# Altium schematic sheet [13]-TYPEC0_PROG.SchDoc: RK3399 SOM Board Design V1.0
size A3; Author: ABC; Organization: Altium Limited; Address1: L3, 12a Rodborough Rd; Address2: Frenchs Forest; Address3: NSW; Address4: Australia 2086; DocumentNumber: 15; SheetNumber: 15; SheetTotal: 21; PROJECT CODE: A_V1.0
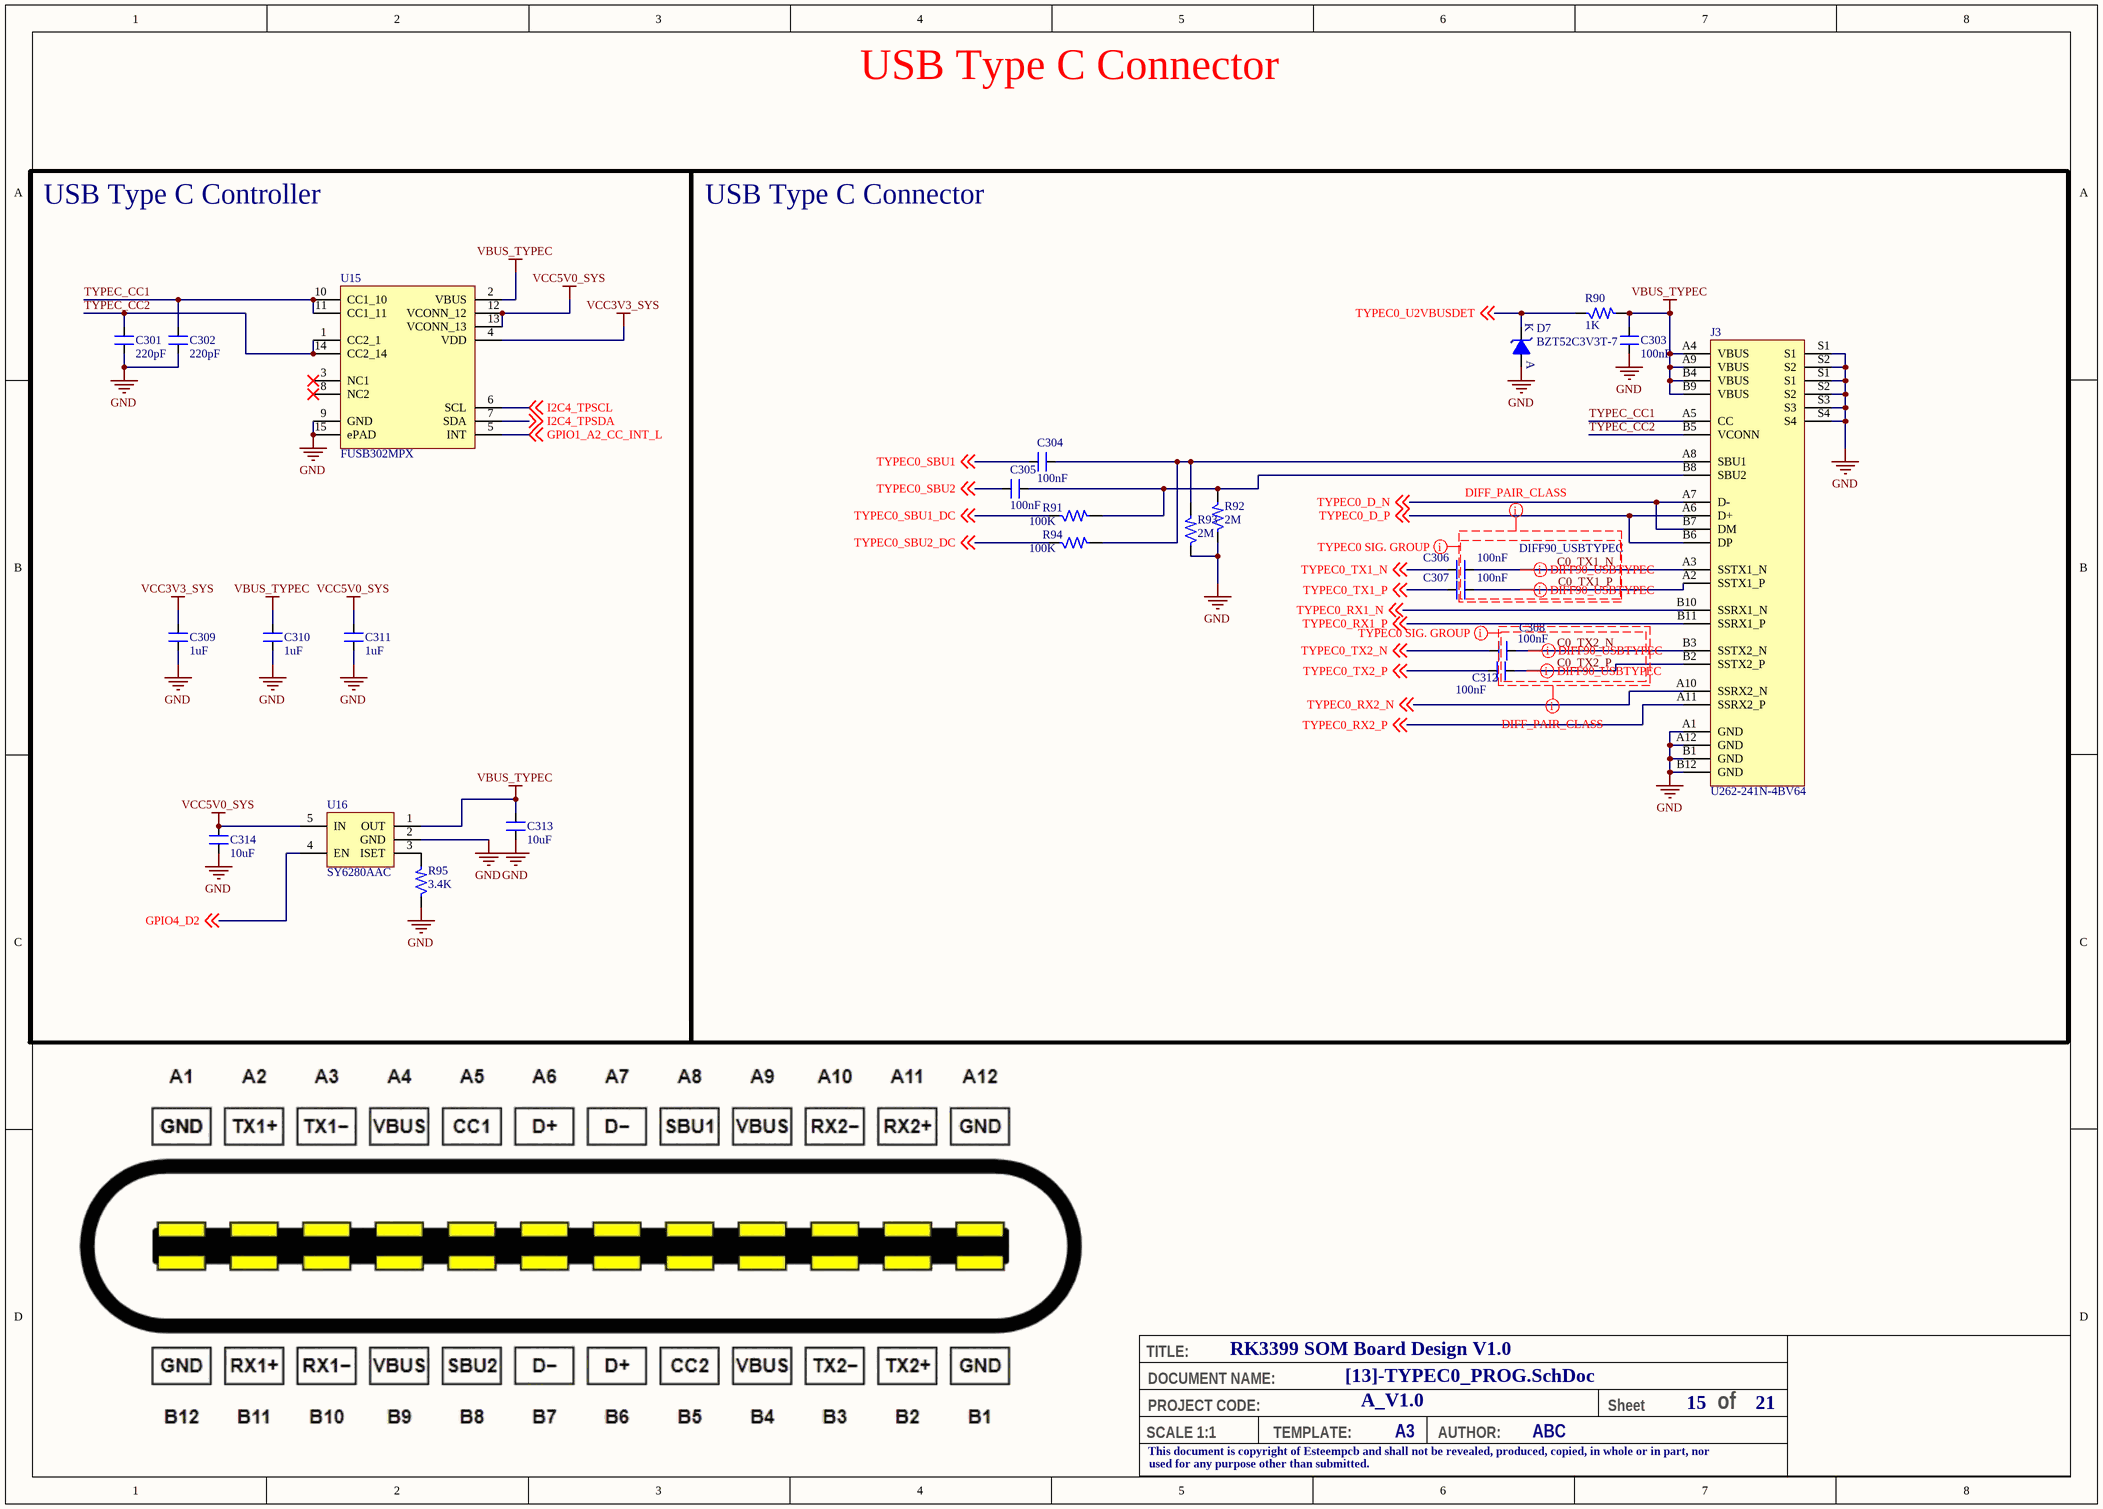
[diagram p0: [13]-TYPEC0_PROG.SchDoc]

## Parts
C301  220pF  [CAP_0402]
C302  220pF  [CAP_0402]
C303  100nF  [CAP_0603]
C304  100nF  [CAP_0402]
C305  100nF  [CAP_0402]
C306  100nF  [CAP_0402]
C307  100nF  [CAP_0402]
C308  100nF  [CAP_0402]
C309  1uF  [CAP_0402]
C310  1uF  [CAP_0402]
C311  1uF  [CAP_0402]
C312  100nF  [CAP_0402]
C313  10uF  [CAP_0402]
C314  10uF  [CAP_0402]
D7  BZT52C3V3T-7  [DIO_SOD523]
J3  U262-241N-4BV64  [CON24_19.64_U262-241N-4BV64_TH_RA]
R90  1K  [RES_0402]
R91  100K  [RES_0402]
R92  2M  [RES_0402]
R93  2M  [RES_0402]
R94  100K  [RES_0402]
R95  3.4K  [RES_0402]
U15  FUSB302MPX  [MLP-14_98.4X98.4_SMD]
U16  SY6280AAC  [SOT23-5]

## Blocks framed on the sheet
USB Type C Controller: C301 C302 C309-C311 C313 C314 R95 U15 U16
USB Type C Connector: C303-C308 C312 D7 J3 R90-R94

## Nets
GND: C301.1 C302.1 C303.1 C309.1 C310.1 C311.1 C313.1 C314.1 D7.A J3.A1(GND) J3.A12(GND) J3.B1(GND) J3.B12(GND) J3.S1 J3.S2 J3.S3 J3.S4 R92.1 R93.1 R95.1 U15.9(GND) U15.15(ePAD) U16.2(GND)
VBUS_TYPEC: C303.2 C310.2 C313.2 J3.A4(VBUS) J3.A9(VBUS) J3.B4(VBUS) J3.B9(VBUS) R90.2 U15.2(VBUS) U16.1(OUT)
VCC3V3_SYS: C309.2 U15.4(VDD)
VCC5V0_SYS: C311.2 C314.2 U15.12(VCONN_12) U15.13(VCONN_13) U16.5(IN)
C0_TX1_N: C306.2 J3.A3(SSTX1_N)
C0_TX1_P: C307.2 J3.A2(SSTX1_P)
C0_TX2_N: C308.2 J3.B3(SSTX2_N)
C0_TX2_P: C312.2 J3.B2(SSTX2_P)
GPIO1_A2_CC_INT_L: U15.5(INT) ; off-sheet GPIO1_A2_CC_INT_L
GPIO4_D2: U16.4(EN) ; off-sheet GPIO4_D2
I2C4_TPSCL: U15.6(SCL) ; off-sheet I2C4_TPSCL
I2C4_TPSDA: U15.7(SDA) ; off-sheet I2C4_TPSDA
TYPEC0_D_N: J3.A7(D-) J3.B7(DM) ; off-sheet TYPEC0_D_N
TYPEC0_D_P: J3.A6(D+) J3.B6(DP) ; off-sheet TYPEC0_D_P
TYPEC0_RX1_N: J3.B10(SSRX1_N) ; off-sheet TYPEC0_RX1_N
TYPEC0_RX1_P: J3.B11(SSRX1_P) ; off-sheet TYPEC0_RX1_P
TYPEC0_RX2_N: J3.A10(SSRX2_N) ; off-sheet TYPEC0_RX2_N
TYPEC0_RX2_P: J3.A11(SSRX2_P) ; off-sheet TYPEC0_RX2_P
TYPEC0_SBU1: C304.1 ; off-sheet TYPEC0_SBU1
TYPEC0_SBU1_DC: R91.1 ; off-sheet TYPEC0_SBU1_DC
TYPEC0_SBU2: C305.1 ; off-sheet TYPEC0_SBU2
TYPEC0_SBU2_DC: R94.1 ; off-sheet TYPEC0_SBU2_DC
TYPEC0_TX1_N: C306.1 ; off-sheet TYPEC0_TX1_N
TYPEC0_TX1_P: C307.1 ; off-sheet TYPEC0_TX1_P
TYPEC0_TX2_N: C308.1 ; off-sheet TYPEC0_TX2_N
TYPEC0_TX2_P: C312.1 ; off-sheet TYPEC0_TX2_P
TYPEC0_U2VBUSDET: D7.K R90.1 ; off-sheet TYPEC0_U2VBUSDET
TYPEC_CC1: C302.2 J3.A5(CC) U15.10(CC1_10) U15.11(CC1_11)
TYPEC_CC2: C301.2 J3.B5(VCONN) U15.1(CC2_1) U15.14(CC2_14)
NetC304_2: C304.2 J3.A8(SBU1) R93.2 R94.2
NetC305_2: C305.2 J3.B8(SBU2) R91.2 R92.2
NetR95_2: R95.2 U16.3(ISET)

Not connected (* = marked no-connect by the designer): U15 3(NC1)* 8(NC2)*

## Layout directives
net class TYPEC0 SIG. GROUP: C0_TX1_N, C0_TX1_P, C0_TX2_N, C0_TX2_P
differential pair; differential pair class DIFF90_USBTYPEC: C0_TX1_N, C0_TX1_P, C0_TX2_N, C0_TX2_P
net class DIFF_PAIR_CLASS: C0_TX1_N, C0_TX1_P, C0_TX2_N, C0_TX2_P

## Notes on the sheet
- USB Type C Connector
- TITLE:
- DOCUMENT NAME:
- SCALE 1:1
- This document is copyright of Esteempcb and shall not be revealed, produced, copied, in whole or in part, nor
- PROJECT CODE:
- TEMPLATE:
- A3
- AUTHOR:
- Sheet
- of
- used for any purpose other than submitted.

## Library data of the parts
C301 C302 = CAP_220pF-10V-10%-0402: 220pF ±10% 10V Ceramic Capacitor X7R 0402 (1005 Metric) /; Manufacturer: KEMET; Manufacturer Part Number: C0402C221K8RAC7867; Case/Package: 0402; Supplier-1: Digikey
C303 = CAP_100nF-10V-5%-0603: 0.1µF ±10% 10V Ceramic Capacitor X7R 0603 (1608 Metric) /; Manufacturer: Yageo; Manufacturer Part Number: CC0603KRX7R6BB104; Case/Package: 0603; Supplier-1: Digikey
C304-C308 C312 = CAP_100nF-25V-10%-0402: 0.1µF ±10% 25V Ceramic Capacitor X7R 0402 (1005 Metric) /; Manufacturer: Walsin Technology Corporation; Manufacturer Part Number: 0402B104K250CT; Case/Package: 0402; Supplier-1: Digikey
C309-C311 = CAP_1uF-10V-10%-0402: 1µF ±10% 10V Ceramic Capacitor X6S 0402 (1005 Metric) /; Manufacturer: Murata Electronics; Manufacturer Part Number: GRT155C81A105KE01D; Case/Package: 0402; Supplier-1: Digikey
C313 C314 = CAP_10uF-10V-20%-0402: 10µF ±20% 10V Ceramic Capacitor X5R 0402 (1005 Metric) /; Manufacturer Part Number: CL05A106MP5NUNC; Manufacturer: Samsung Electro-Mechanics; Case/Package: 0402; Supplier-1: Digikey
D7 = DIO-Z_3.3V-300mW-SOD-523: Zener Diode 3.3V 300mW ±6% Surface Mount SOD-523 /; Manufacturer: Diodes Incorporated; Manufacturer Part Number: BZT52C3V3T-7; Case/Package: SOD523; Supplier-1: Digikey
J3 = CON-TYPEC_U262-241N-4BV64-SMD: USB - Type C Female 24 SMD USB Connectors RoHS; Manufacturer: XKB Connectivity; Manufacturer Part Number: U262-241N-4BV64; Case/Package: SMD; Supplier-1: LCSC
R90 = RES_1K-0.1W-1%-0402: 1 kOhms ±1% 0.1W, 1/10W Chip Resistor 0402 (1005 Metric) Anti-Sulfur Thin Film /; Manufacturer: Vishay Beyschlag/Draloric/BC Components; Manufacturer Part Number: MCS04020C1001FE000; Case/Package: 0402; Supplier-1: Digikey
R91 R94 = RES_100K-0.1W-1%-0402: 100 kOhms ±1% 0.1W, 1/10W Chip Resistor 0402 (1005 Metric) Anti-Sulfur Thin Film /; Manufacturer: Vishay Beyschlag/Draloric/BC Components; Manufacturer Part Number: MCS04020C1003FE000; Case/Package: 0402; Supplier-1: Digikey
R92 R93 = RES_2M-0.1W-1%-0402: 2 MOhms ±1% 0.1W, 1/10W Chip Resistor 0402 (1005 Metric) Anti-Sulfur Thin Film /; Manufacturer: Vishay Beyschlag/Draloric/BC Components; Manufacturer Part Number: MCS04020C2004FE000; Case/Package: 0402; Supplier-1: Digikey
R95 = RES_3.4K-0.1W-1%-0402: 3.4 kOhms ±1% 0.1W, 1/10W Chip Resistor 0402 (1005 Metric) Automotive AEC-Q200 Thick Film /; Manufacturer: Panasonic Electronic Components; Manufacturer Part Number: ERJ-2RKF3401X; Case/Package: 0402; Supplier-1: Digikey
U15 = IC_FUSB302MPX: USB Controller USB 3.1 USB Interface 14-MLP (2.5x2.5); Manufacturer: ON Semiconductor; Manufacturer Part Number: FUSB302MPX; Case/Package: 14-MLP; Supplier-1: Digikey
U16 = REG-ADJ_5.5V-5.5V-1.25A-SOT-23-5: SOT-23-5 PMIC - Power Distribution Switches RoHS; Manufacturer: Silergy Corp; Manufacturer Part Number: SY6280AAC; Case/Package: SOT-23-5; Supplier-1: LCSC